# EAGLE board R42_ECU (EAGLE 9.6.2), part 1 of 2
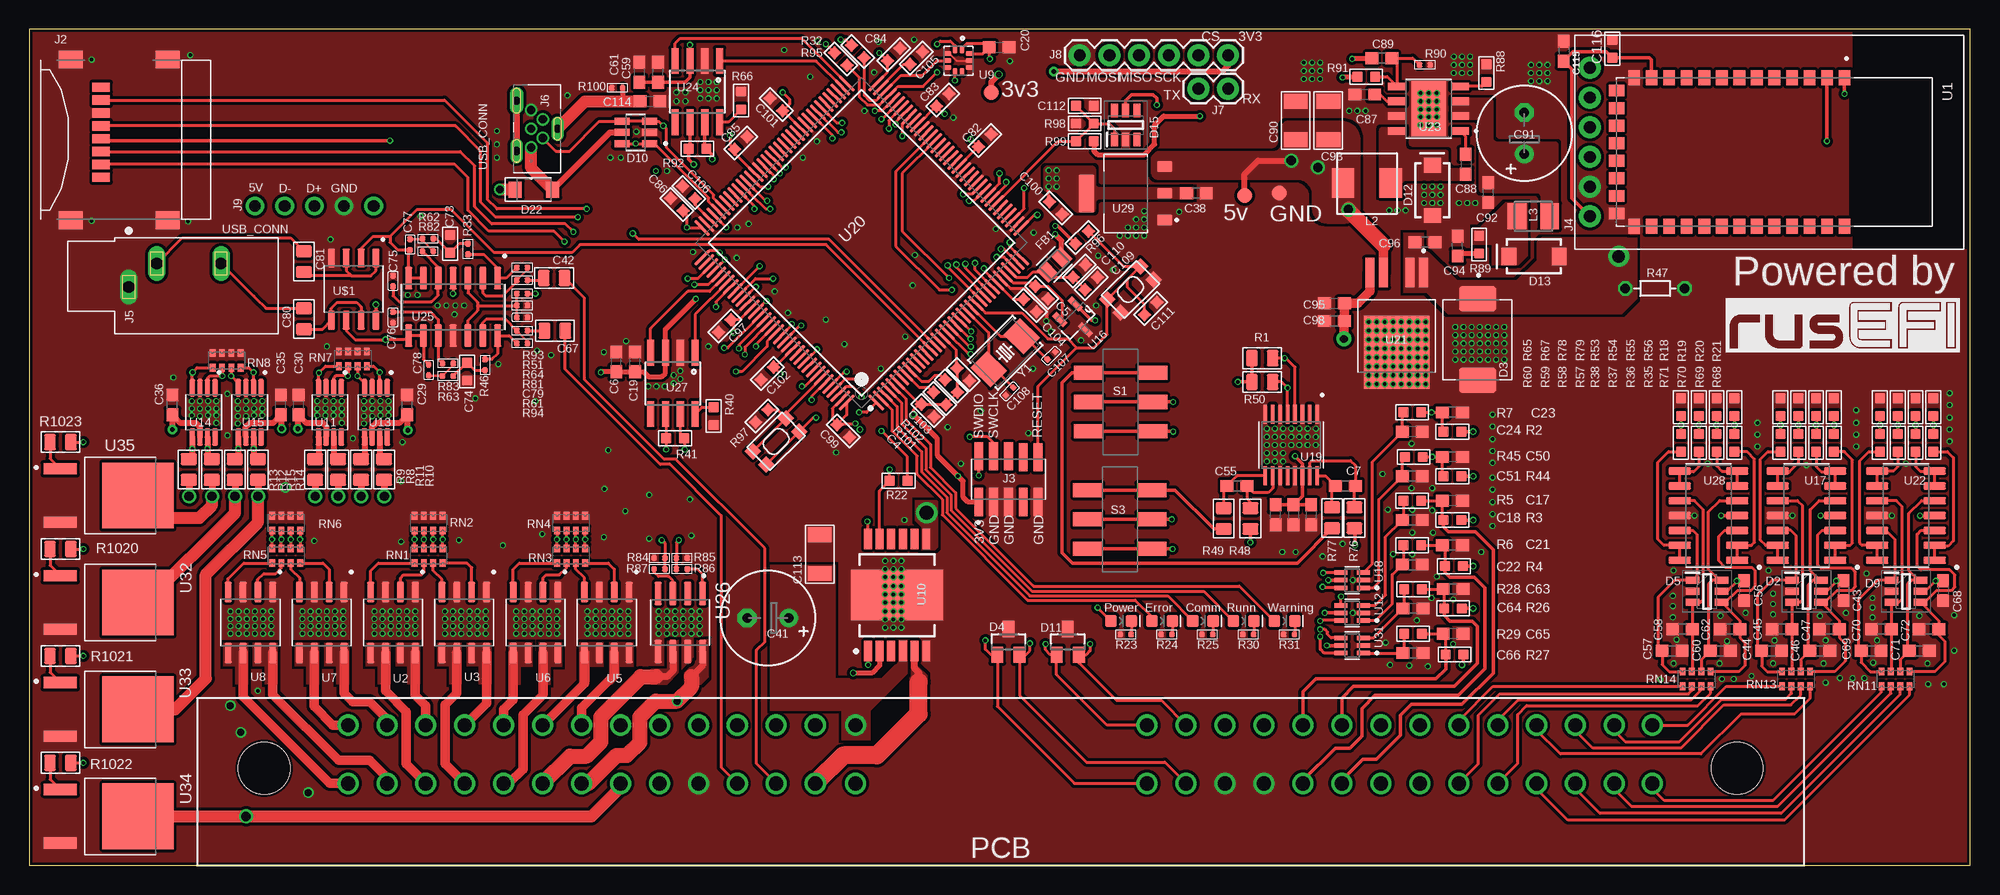
[diagram p7: board, top side]
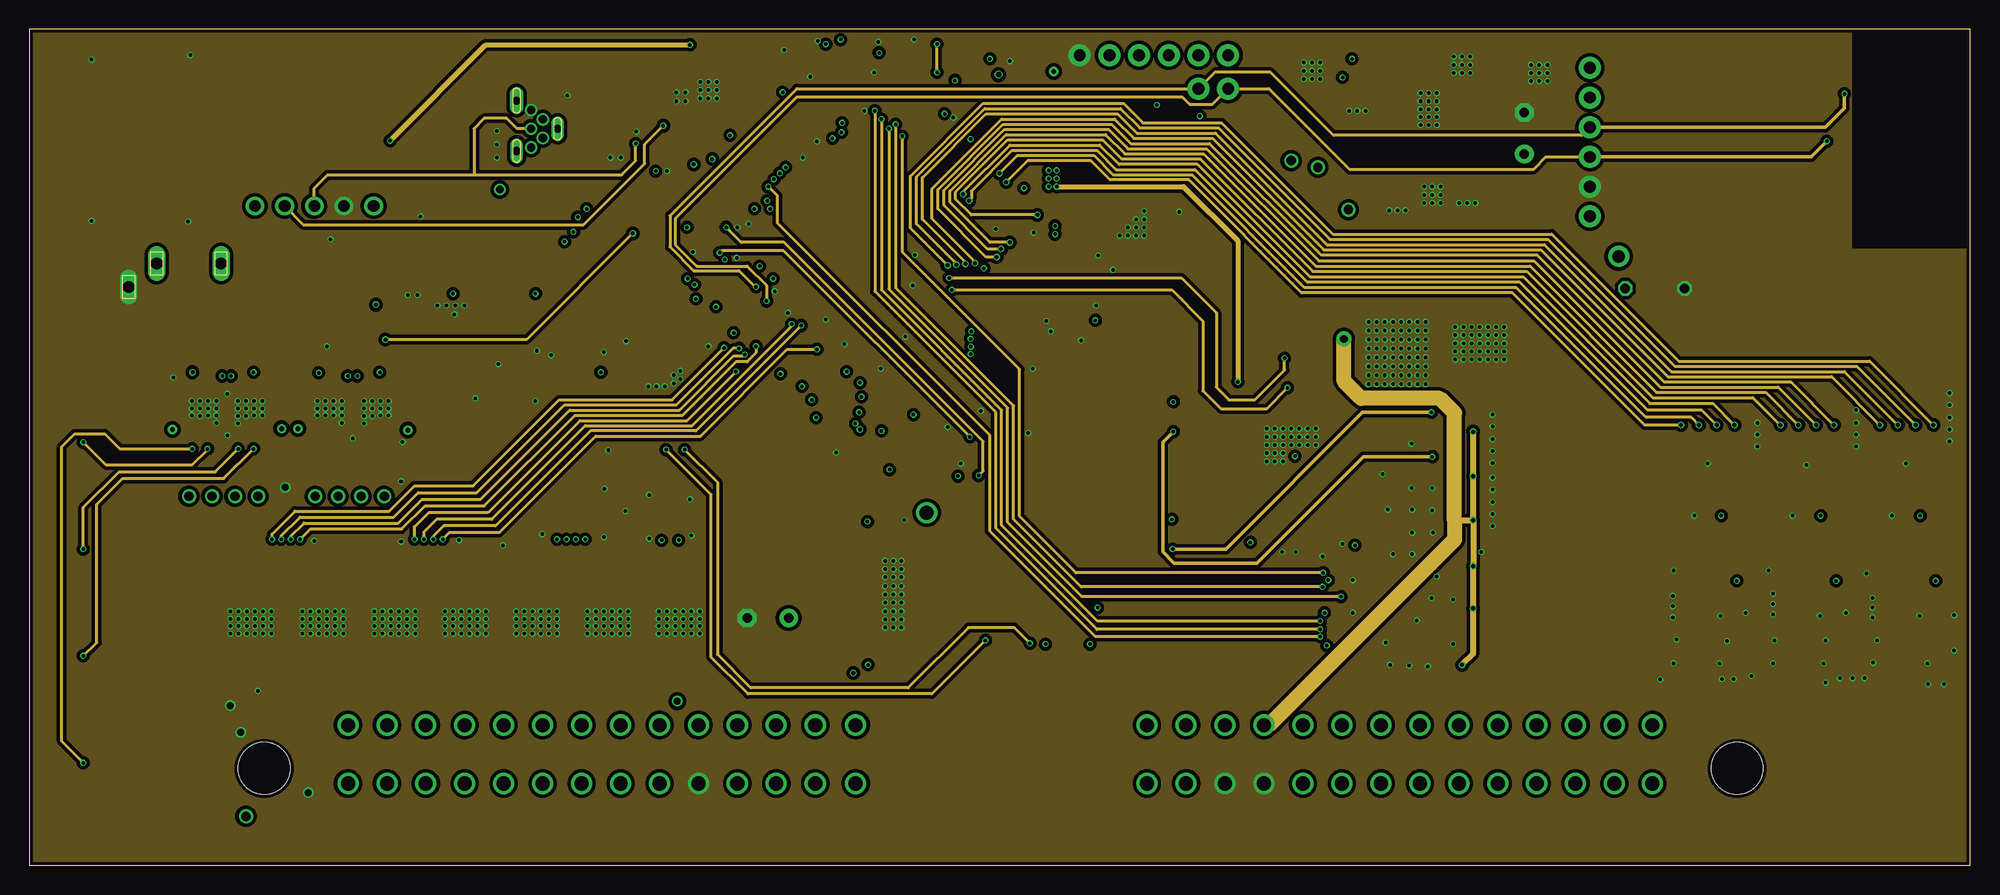
[diagram p8: board, inner layer Route2]
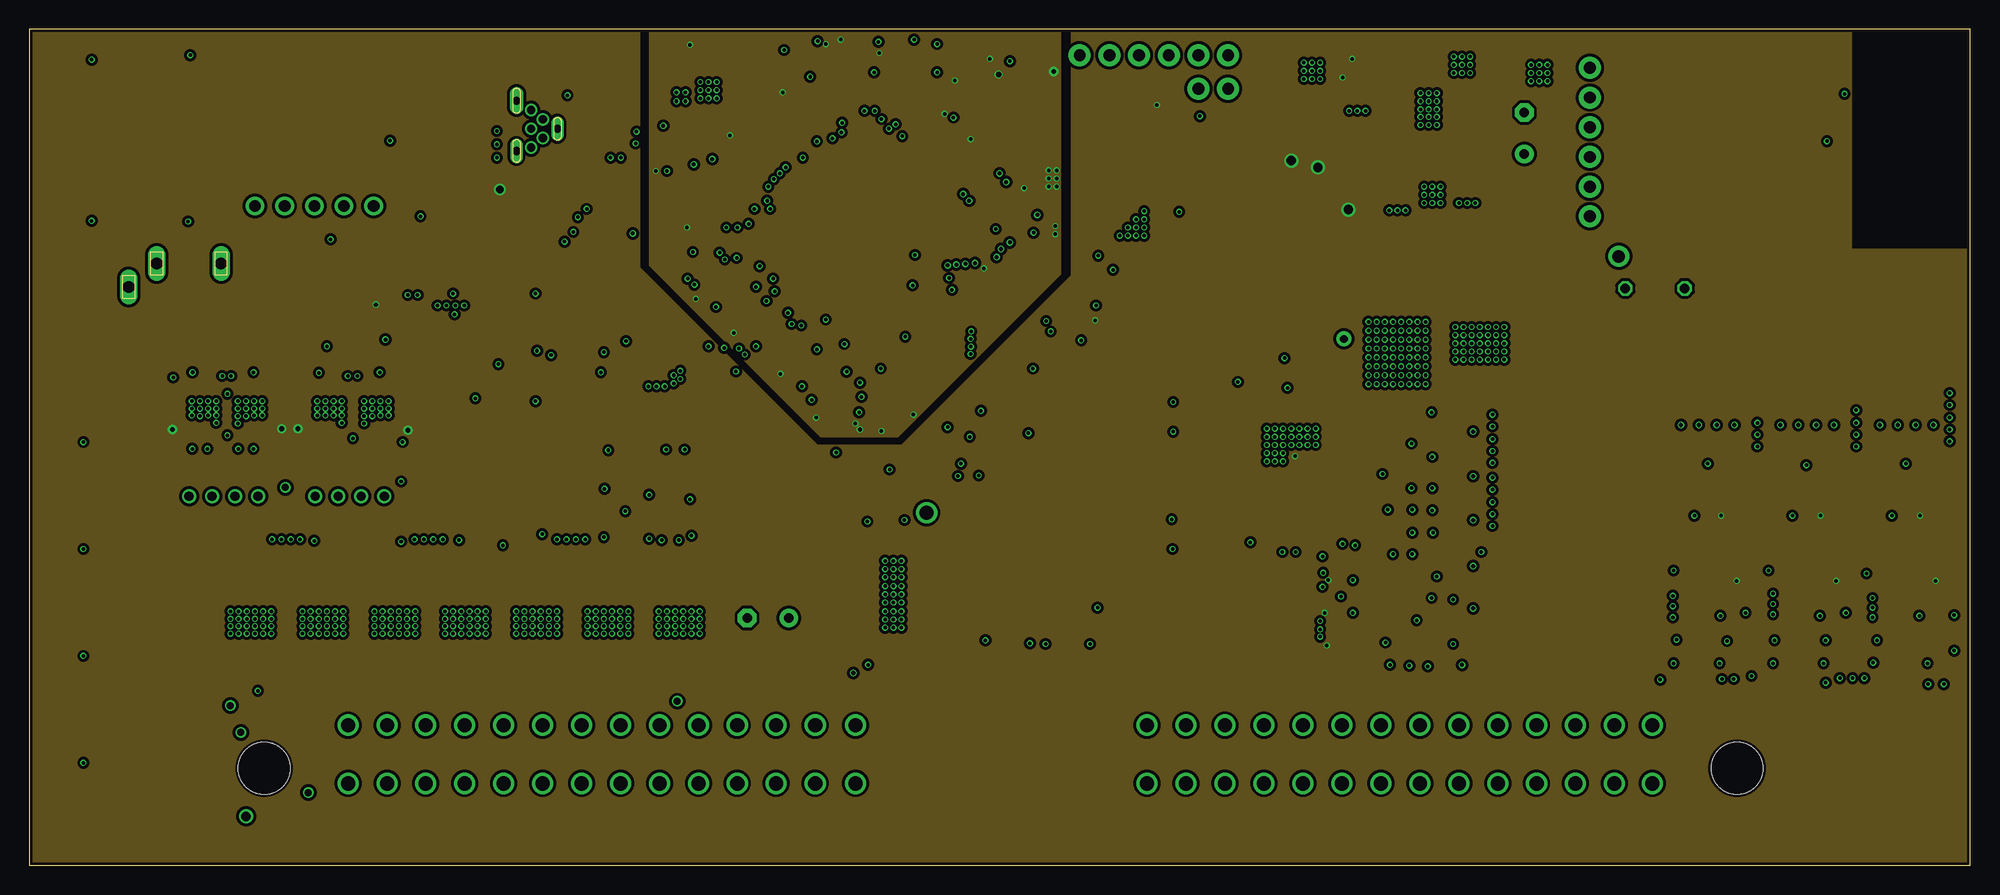
[diagram p9: board, inner layer Route15]
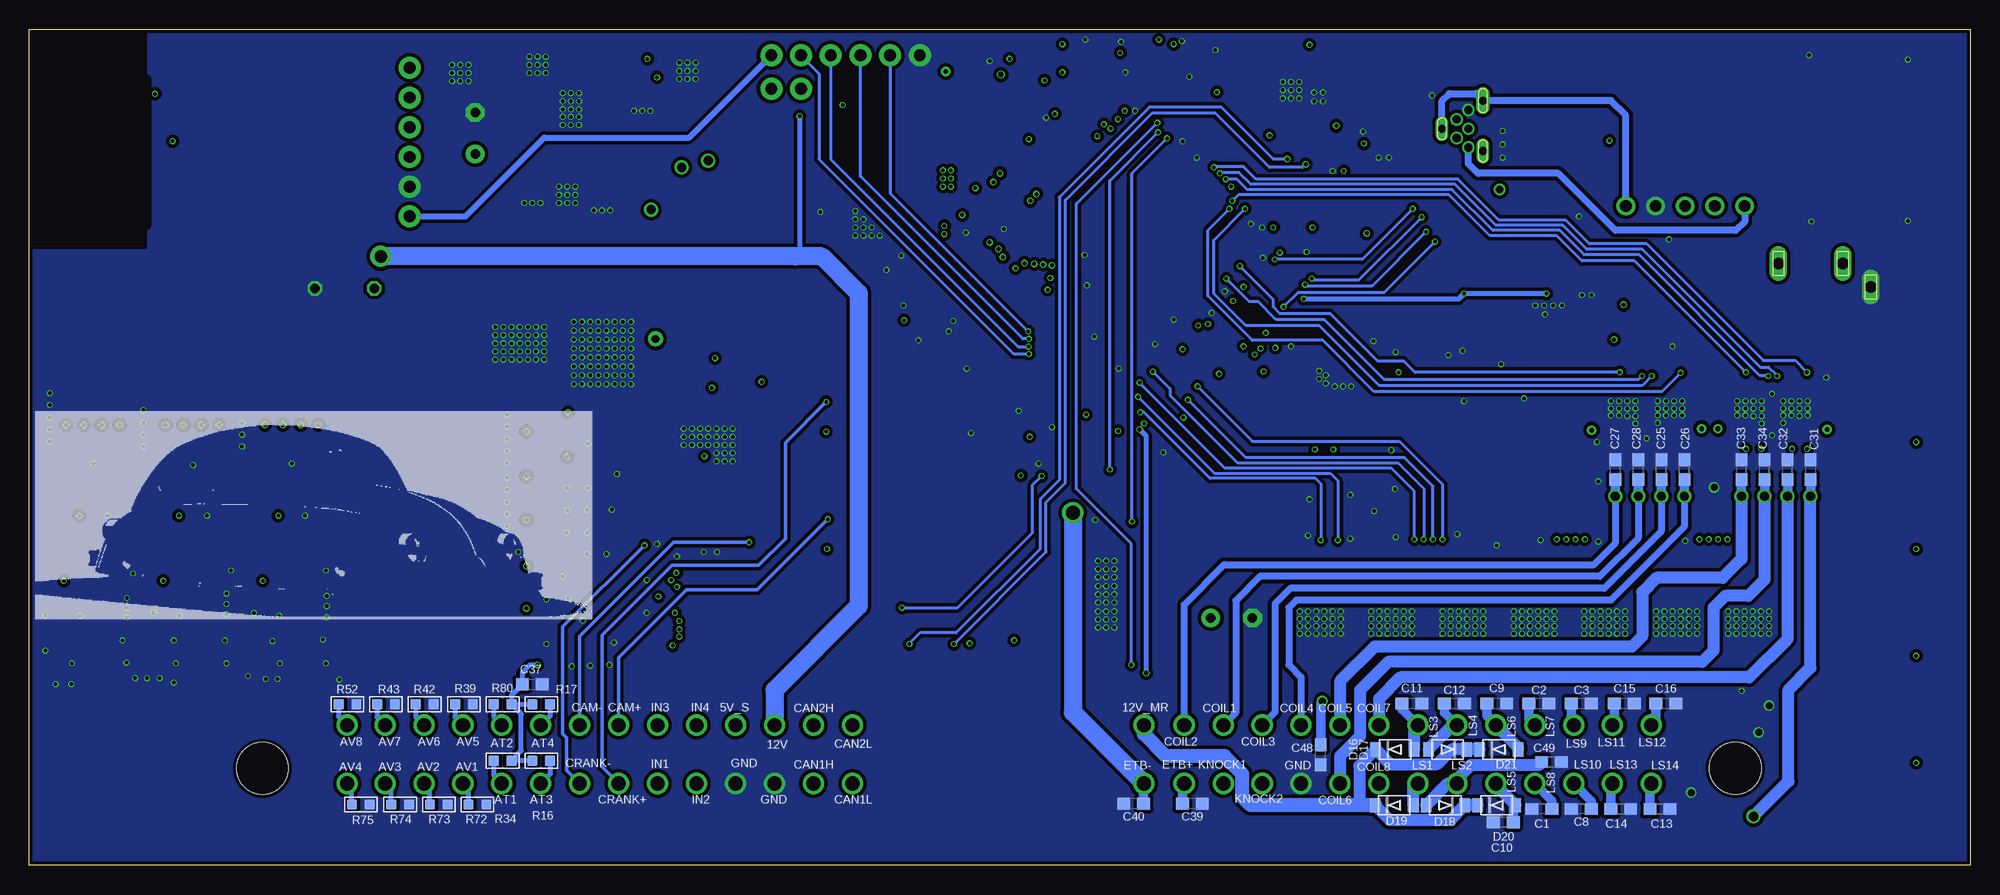
[diagram p10: board, bottom side, seen from below]

Size 166.03 x 71.5 mm. Coordinates in mm from the lower left corner, seen from the top.
Outline: 0,0 166.03,0 166.03,71.5 0,71.5 0,0
Copper layers (1+2*15+16): Top 0.035mm / dielectric 0.2mm / Route2 0.0175mm / dielectric 1.065mm / Route15 0.0175mm / dielectric 0.2mm / Bottom 0.035mm
Design rules "4-Layer-JLC": minimum track width 3.5mil, minimum drill 0.2mm, track to track 3.5mil, track to pad 5mil, pad to pad 5mil, via to via 5mil, smd to smd 0mil, copper to edge 0.1mm, drill to drill 5mil, minimum pad ring 4mil, minimum via ring 4mil, stop-mask expansion 3mil, vias tented up to drill 100mil, thermal gap 10mil

## Footprints (pad centres in the part's own frame; a part is rotated, then mirrored left to right if it is on the bottom)
0603 = smd 1.1 x 1: 1 -0.85,0; 2 0.85,0
C0603 = smd 0.889 x 0.889: 1 0,0.762; 2 0,-0.762
E3,5-8 = drill 0.813 pad 1.6: + -1.778,0 | drill 0.813 pad 1.6 octagon: - 1.778,0
C0805 = smd 1.397 x 1.016: 1 0,0.889; 2 0,-0.889
C0402 = smd 0.5 x 0.5: 1 0,0.463; 2 0,-0.463
C1206 = smd 1.27 x 2.032: 1 -1.651,0; 2 1.651,0
LED-0603 = smd 1 x 1: A -0.877,0; C 0.877,0
SOT95P280X145-6N = smd 1.15 x 0.6: 1 -1.25,0.95; 2 -1.25,0; 3 -1.25,-0.95; 4 1.25,-0.95; 5 1.25,0; 6 1.25,0.95
DIOM7959X262N = smd 2.18 x 3.12: 1 -3.485,0; 2 3.485,0
SOT23 = smd 1 x 1.4: 1 -0.95,-1.1; 2 0.95,-1.1; 3 0,1.1
SOT95P280X145-6N' = smd 1.36 x 0.6: 1 -1.175,0.95; 2 -1.175,0; 3 -1.175,-0.95; 4 1.175,-0.95; 5 1.175,0; 6 1.175,0.95
SMA-DIODE = smd 1.27 x 1.47: A -2.15,0; C 2.15,0
SOD-123FL = smd 0.91 x 1.22: A 1.637,0; C -1.637,0
SODFL3718X115 = smd 1.115 x 1.361: 1 -1.6,0; 2 1.6,0
BEADC2012X105N = smd 1.165 x 1.465: 1 -0.875,0; 2 0.875,0
MOLEX_47219-2001 = smd 0.8 x 1.5: 1 3.2,-2.1; 2 2.1,-2.1; 3 1,-2.1; 4 -0.1,-2.1; 5 -1.2,-2.1; 6 -2.3,-2.1; 7 -3.4,-2.1; 8 -4.5,-2.1 | smd 1.5 x 2.05: G1 6.875,-4.7; G2 6.875,3.6; G3 -6.875,3.6; G4 -6.875,-4.7
62131021021 = smd 0.75 x 2.4: 1 -2.54,-1.95; 2 -2.54,1.95; 3 -1.27,-1.95; 4 -1.27,1.95; 5 0,-1.95; 6 0,1.95; 7 1.27,-1.95; 8 1.27,1.86; 9 2.54,-1.95; 10 2.54,1.86
1X06_NO_SILK = drill 1.016 pad 1.88: 1 0,0; 2 2.54,0; 3 5.08,0; 4 7.62,0; 5 10.16,0; 6 12.7,0
CUI_SJ1-3533NG = drill 1 long: 1 0,0; 2 2.4,2; 3 7.9,2
CONN_1734753-1 = drill 0.7 pad 1: 1 -1.6,0.5; 2 -0.8,-0.5; 3 0,0.5; 4 0.8,-0.5; 5 1.6,0.5 | drill 0.7 long: S1 -1.9,1.75; S3 0,-1.75 | drill 0.7 pad 1.15 long: S2 2.4,1.75
1X02 = drill 1.016 pad 1.88: 1 0,0; 2 2.54,0
1X06 = drill 1.016 pad 1.88: 1 0,0; 2 2.54,0; 3 5.08,0; 4 7.62,0; 5 10.16,0; 6 12.7,0
1X05_NO_SILK = drill 1 pad 1.6: 1 0,0; 2 2.54,0; 3 5.08,0; 4 7.62,0; 5 10.16,0
0503 = smd 1.9 x 2.5: P$1 0,0; P$2 4.1,0
L3225M = smd 1.6 x 2.2: 1 -1.4,0; 2 1.4,0
R0805 = smd 1.397 x 1.016: 1 0,0.889; 2 0,-0.889
R0603 = smd 0.889 x 0.889: 1 0,0.762; 2 0,-0.762
R0402 = smd 0.5 x 0.5: 1 0,0.463; 2 0,-0.463
R-5 = drill 0.813 octagon: 1 -2.54,0; 2 2.54,0
0603-ARC = smd 0.5 x 0.65: 1 -1.2,-0.625; 2 -0.4,-0.625; 3 0.4,-0.625; 4 1.2,-0.625; 5 1.2,0.625; 6 0.4,0.625; 7 -0.4,0.625; 8 -1.2,0.625
SW_JS202011SCQN = smd 1.2 x 2.5: 1 -2.5,-2.75; 2 0,-2.75; 3 2.5,-2.75; 4 -2.5,2.75; 5 0,2.75; 6 2.5,2.75
KMR2 = smd 1 x 1: 1 2,0.8; 2 2,-0.8; 3 -2,0.8; 4 -2,-0.8
PAD.03X.05 = smd 1.27 x 1.27: P$1 0,0
XCVR_HC-05 = smd 1.3 x 1: 1 -6.35,6.325; 2 -6.35,4.825; 3 -6.35,3.325; 4 -6.35,1.825; 5 -6.35,0.325; 6 -6.35,-1.175; 7 -6.35,-2.675; 8 -6.35,-4.175; 9 -6.35,-5.675; 10 -6.35,-7.175; 11 -6.35,-8.675; 12 -6.35,-10.175; 13 -6.35,-11.675; 22 6.35,-11.675; 23 6.35,-10.175; 24 6.35,-8.675; 25 6.35,-7.175; 26 6.35,-5.675; 27 6.35,-4.175; 28 6.35,-2.675; 29 6.35,-1.175; 30 6.35,0.325; 31 6.35,1.825; 32 6.35,3.325; 33 6.35,4.825; 34 6.35,6.325 | smd 1 x 1.3: 14 -5.25,-13.175; 15 -3.75,-13.175; 16 -2.25,-13.175; 17 -0.75,-13.175; 18 0.75,-13.175; 19 2.25,-13.175; 20 3.75,-13.175; 21 5.25,-13.175
SOIC127P600X175-8N = smd 1.71 x 0.61: 1 -2.605,1.905; 2 -2.605,0.635; 3 -2.605,-0.635; 4 -2.605,-1.905; 5 2.605,-1.905; 6 2.605,-0.635; 7 2.605,0.635; 8 2.605,1.905
PQFN60P250X250X80-10N = smd 0.59 x 0.4: 1 -0.92,0.3; 2 -0.92,-0.3; 6 0.92,-0.3; 7 0.92,0.3 | smd 0.4 x 0.59: 3 -0.6,-0.92; 4 0,-0.92; 5 0.6,-0.92; 8 0.6,0.92; 9 0,0.92; 10 -0.6,0.92
SOP100P1030X260-13N = smd 1.753 x 0.66: 1 -4.801,2.489; 2 -4.801,1.499; 3 -4.801,0.508; 4 -4.801,-0.508; 5 -4.801,-1.499; 6 -4.801,-2.489; 7 4.801,-2.489; 8 4.801,-1.499; 9 4.801,-0.508; 10 4.801,0.508; 11 4.801,1.499; 12 4.801,2.489 | smd 4.293 x 7.899: 13 0,0
SOP65P490X110-8N = smd 1.5 x 0.49: 1 -2.105,0.975; 2 -2.105,0.325; 3 -2.105,-0.325; 4 -2.105,-0.975; 5 2.105,-0.975; 6 2.105,-0.325; 7 2.105,0.325; 8 2.105,0.975
SOP65P210X110-6N = smd 1.19 x 0.4: 1 -0.96,0.65; 2 -0.96,0; 3 -0.96,-0.65; 4 0.96,-0.65; 5 0.96,0; 6 0.96,0.65
SOT95P237X112-3N = smd 1.321 x 0.559: 1 -1.092,0.94; 2 -1.092,-0.94 | smd 1.321 x 0.508: 3 1.092,0
SOIC127P600X175-14N = smd 1.9 x 0.6: 1 -2.455,3.81; 2 -2.455,2.54; 3 -2.455,1.27; 4 -2.455,0; 5 -2.455,-1.27; 6 -2.455,-2.54; 7 -2.455,-3.81; 8 2.455,-3.81; 9 2.455,-2.54; 10 2.455,-1.27; 11 2.455,0; 12 2.455,1.27; 13 2.455,2.54; 14 2.455,3.81
SOP63P602X175-16N = smd 1.64 x 0.41: 1 -2.635,2.223; 2 -2.635,1.587; 3 -2.635,0.953; 4 -2.635,0.318; 5 -2.635,-0.318; 6 -2.635,-0.953; 7 -2.635,-1.587; 8 -2.635,-2.223; 9 2.635,-2.223; 10 2.635,-1.587; 11 2.635,-0.953; 12 2.635,-0.318; 13 2.635,0.318; 14 2.635,0.953; 15 2.635,1.587; 16 2.635,2.223
STMICROELECTRONICS_STM32F429ZGT6_2 = smd 1.8 x 0.3: 1 -10.55,8.75; 2 -10.55,8.25; 3 -10.55,7.75; 4 -10.55,7.25; 5 -10.55,6.75; 6 -10.55,6.25; 7 -10.55,5.75; 8 -10.55,5.25; 9 -10.55,4.75; 10 -10.55,4.25; 11 -10.55,3.75; 12 -10.55,3.25; 13 -10.55,2.75; 14 -10.55,2.25; 15 -10.55,1.75; 16 -10.55,1.25; 17 -10.55,0.75; 18 -10.55,0.25; 19 -10.55,-0.25; 20 -10.55,-0.75; 21 -10.55,-1.25; 22 -10.55,-1.75; 23 -10.55,-2.25; 24 -10.55,-2.75; 25 -10.55,-3.25; 26 -10.55,-3.75; 27 -10.55,-4.25; 28 -10.55,-4.75; 29 -10.55,-5.25; 30 -10.55,-5.75; 31 -10.55,-6.25; 32 -10.55,-6.75; 33 -10.55,-7.25; 34 -10.55,-7.75; 35 -10.55,-8.25; 36 -10.55,-8.75; 73 10.55,-8.75; 74 10.55,-8.25; 75 10.55,-7.75; 76 10.55,-7.25; 77 10.55,-6.75; 78 10.55,-6.25; 79 10.55,-5.75; 80 10.55,-5.25; 81 10.55,-4.75; 82 10.55,-4.25; 83 10.55,-3.75; 84 10.55,-3.25; 85 10.55,-2.75; 86 10.55,-2.25; 87 10.55,-1.75; 88 10.55,-1.25; 89 10.55,-0.75; 90 10.55,-0.25; 91 10.55,0.25; 92 10.55,0.75; 93 10.55,1.25; 94 10.55,1.75; 95 10.55,2.25; 96 10.55,2.75; 97 10.55,3.25; 98 10.55,3.75; 99 10.55,4.25; 100 10.55,4.75; 101 10.55,5.25; 102 10.55,5.75; 103 10.55,6.25; 104 10.55,6.75; 105 10.55,7.25; 106 10.55,7.75; 107 10.55,8.25; 108 10.55,8.75 | smd 0.3 x 1.8: 37 -8.75,-10.55; 38 -8.25,-10.55; 39 -7.75,-10.55; 40 -7.25,-10.55; 41 -6.75,-10.55; 42 -6.25,-10.55; 43 -5.75,-10.55; 44 -5.25,-10.55; 45 -4.75,-10.55; 46 -4.25,-10.55; 47 -3.75,-10.55; 48 -3.25,-10.55; 49 -2.75,-10.55; 50 -2.25,-10.55; 51 -1.75,-10.55; 52 -1.25,-10.55; 53 -0.75,-10.55; 54 -0.25,-10.55; 55 0.25,-10.55; 56 0.75,-10.55; 57 1.25,-10.55; 58 1.75,-10.55; 59 2.25,-10.55; 60 2.75,-10.55; 61 3.25,-10.55; 62 3.75,-10.55; 63 4.25,-10.55; 64 4.75,-10.55; 65 5.25,-10.55; 66 5.75,-10.55; 67 6.25,-10.55; 68 6.75,-10.55; 69 7.25,-10.55; 70 7.75,-10.55; 71 8.25,-10.55; 72 8.75,-10.55; 109 8.75,10.55; 110 8.25,10.55; 111 7.75,10.55; 112 7.25,10.55; 113 6.75,10.55; 114 6.25,10.55; 115 5.75,10.55; 116 5.25,10.55; 117 4.75,10.55; 118 4.25,10.55; 119 3.75,10.55; 120 3.25,10.55; 121 2.75,10.55; 122 2.25,10.55; 123 1.75,10.55; 124 1.25,10.55; 125 0.75,10.55; 126 0.25,10.55; 127 -0.25,10.55; 128 -0.75,10.55; 129 -1.25,10.55; 130 -1.75,10.55; 131 -2.25,10.55; 132 -2.75,10.55; 133 -3.25,10.55; 134 -3.75,10.55; 135 -4.25,10.55; 136 -4.75,10.55; 137 -5.25,10.55; 138 -5.75,10.55; 139 -6.25,10.55; 140 -6.75,10.55; 141 -7.25,10.55; 142 -7.75,10.55; 143 -8.25,10.55; 144 -8.75,10.55
TO114P998X235-5 = smd 2.52 x 0.79: 1 -4.34,2.28; 2 -4.34,1.14; 4 -4.34,-1.14; 5 -4.34,-2.28 | smd 6.23 x 5.57: 3 2.48,0
VREG_LM5017MR/NOPB = smd 1.55 x 0.6: 1 -2.7,1.905; 2 -2.7,0.635; 3 -2.7,-0.635; 4 -2.7,-1.905; 5 2.7,-1.905; 6 2.7,-0.635; 7 2.7,0.635; 8 2.7,1.905 | smd 2.95 x 4.9: 9 0,0
SO08 = smd 0.61 x 2.21: 1 -1.905,-2.616; 2 -0.635,-2.616; 3 0.635,-2.616; 4 1.905,-2.616; 5 1.905,2.616; 6 0.635,2.616; 7 -0.635,2.616; 8 -1.905,2.616
SOIC127P600X175-8N' = smd 1.97 x 0.6: 1 -2.475,1.905; 2 -2.475,0.635; 3 -2.475,-0.635; 4 -2.475,-1.905; 5 2.475,-1.905; 6 2.475,-0.635; 7 2.475,0.635; 8 2.475,1.905
SOT229P700X180-4N = smd 0.93 x 1.31: 1 -2.29,-3.345; 2 0,-3.345; 3 2.29,-3.345 | smd 3.24 x 1.31: 4 0,3.345
TO229P990X238-4N = smd 2.83 x 0.97: 1 -4.14,2.29; 3 -4.14,-2.29 | smd 6.09 x 5.63: 4 2.51,0
SOIC127P599X175-8N = smd 1.58 x 0.6: 1 -2.67,1.905; 2 -2.67,0.635; 3 -2.67,-0.635; 4 -2.67,-1.905; 5 2.67,-1.905; 6 2.67,-0.635; 7 2.67,0.635; 8 2.67,1.905
211PL562L0011 = drill 1.2: P1 -55.83,-2.5; P2 -52.5,-2.5; P3 -49.17,-2.5; P4 -45.84,-2.5; P5 -42.51,-2.5; P6 -39.18,-2.5; P7 -35.85,-2.5; P8 -32.52,-2.5; P9 -29.19,-2.5; P10 -25.86,-2.5; P11 -22.53,-2.5; P12 -19.2,-2.5; P13 -15.86,-2.5; P14 -12.4,-2.5; P15 -12.4,2.5; P16 -15.86,2.5; P17 -19.2,2.5; P18 -22.53,2.5; P19 -25.86,2.5; P20 -29.19,2.5; P21 -32.52,2.5; P22 -35.85,2.5; P23 -39.18,2.5; P24 -42.51,2.5; P25 -45.84,2.5; P26 -49.17,2.5; P27 -52.5,2.5; P28 -55.83,2.5; P29 12.5,-2.5; P30 15.86,-2.5; P31 19.2,-2.5; P32 22.53,-2.5; P33 25.86,-2.5; P34 29.19,-2.5; P35 32.52,-2.5; P36 35.85,-2.5; P37 39.18,-2.5; P38 42.51,-2.5; P39 45.84,-2.5; P40 49.17,-2.5; P41 52.5,-2.5; P42 55.73,-2.5; P43 55.73,2.5; P44 52.5,2.5; P45 49.17,2.5; P46 45.84,2.5; P47 42.51,2.5; P48 39.18,2.5; P49 35.85,2.5; P50 32.52,2.5; P51 29.19,2.5; P52 25.86,2.5; P53 22.53,2.5; P54 19.2,2.5; P55 15.86,2.5; P56 12.5,2.5 | hole 4.4: -63,-1.2; 63,-1.2
CRYSTAL_2-SMD-5X3 = smd 2 x 2.4: 1 -2,0; 2 2,0

## Placement (x,y rotation side)
C1  10nF  [0603]  36.64,4.83 180 bottom
C2  10nF  [0603]  36.89,13.84 0 bottom
C3  10nF  [0603]  33.27,13.84 0 bottom
C4  10nf  [C0603]  76.84,38.91 45 top
C5  10nf  [C0603]  85.6,47.86 45 top
C6  1.0uF  [0603]  50.23,43.05 90 top
C7  1nF  [0603]  112.59,32.45 0 top
C8  10nF  [0603]  33.27,4.83 180 bottom
C9  10nF  [0603]  40.51,13.84 0 bottom
C10  10nF  [0603]  39.94,3.68 180 bottom
C11  10nF  [0603]  47.75,13.84 0 bottom
C12  10nF  [0603]  44.13,13.84 0 bottom
C13  10nF  [0603]  26.54,4.83 0 bottom
C14  10nF  [0603]  29.91,4.83 0 bottom
C15  10nF  [0603]  29.59,13.84 0 bottom
C16  10nF  [0603]  26.04,13.84 0 bottom
C17  1nF  [0603]  121.73,31.18 180 top
C18  1nF  [0603]  118.3,29.53 180 top
C19  100nF  [0603]  51.82,43.05 90 top
C20  100nF  [0603]  82.97,69.95 0 top
C21  1nF  [0603]  121.73,27.37 180 top
C22  1nF  [0603]  118.3,25.72 0 top
C23  1nF  [0603]  121.73,38.73 180 top
C24  1nF  [0603]  118.3,37.08 180 top
C25  10nF  [0603]  26.42,33.85 90 bottom
C26  10nF  [0603]  24.45,33.85 90 bottom
C27  10nF  [0603]  30.35,33.85 90 bottom
C28  10nF  [0603]  28.38,33.85 90 bottom
C29  100nF  [0603]  32.32,39.37 90 top
C30  100nF  [0603]  23.05,39.37 90 top
C31  10nF  [0603]  15.62,33.85 90 bottom
C32  10nF  [0603]  13.65,33.85 90 bottom
C33  10nF  [0603]  19.56,33.85 90 bottom
C34  10nF  [0603]  17.59,33.85 90 bottom
C35  100nF  [0603]  21.53,39.37 90 top
C36  100nF  [0603]  12.26,39.37 90 top
C37  100nF  [0603]  123,15.49 0 bottom
C38  4.7uF  [0603]  99.82,57.47 180 top
C39  10nF  [0603]  66.55,5.27 180 bottom
C40  10nF  [0603]  71.56,5.27 180 bottom
C41  56uF  [E3,5-8]  63.18,21.15 180 top
C42  3.3nf  [C0805]  44.89,50.23 270 top
C43  33nF  [0603]  155.19,23.5 270 top
C44  100nF  [0603]  149.03,18.35 0 top
C45  100nF  [0603]  149.92,20.19 180 top
C46  100nF  [0603]  153.16,18.35 0 top
C47  100nF  [0603]  153.99,20.19 180 top
C48  10nF  [0603]  55.56,9.46 90 bottom
C49  10nF  [0603]  35.81,8.83 180 bottom
C50  1nF  [0603]  121.73,34.92 180 top
C51  1nF  [0603]  118.3,33.27 180 top
C52  100nF  [0603]  106.62,29.97 90 top
C53  1.0uF  [0603]  108.14,29.97 270 top
C54  10nF  [0603]  109.66,29.97 90 top
C55  1nF  [0603]  103.31,32.45 0 top
C56  33nF  [0603]  146.69,23.5 270 top
C57  100nF  [0603]  140.53,18.35 0 top
C58  100nF  [0603]  141.41,20.19 180 top
C59  1.0uF  [0603]  53.78,67.82 90 top
C60  100nF  [0603]  144.65,18.35 0 top
C61  100nF  [0603]  52.2,67.82 90 top
C62  100nF  [0603]  145.48,20.19 180 top
C63  1nF  [0603]  121.79,23.62 180 top
C64  1nF  [0603]  118.36,21.97 180 top
C65  1nF  [0603]  121.79,19.81 180 top
C66  1nF  [0603]  118.36,18.16 0 top
C67  3.3nf  [C0805]  44.96,45.72 270 top
C68  33nF  [0603]  163.7,23.5 270 top
C69  100nF  [0603]  157.54,18.35 0 top
C70  100nF  [0603]  158.43,20.19 180 top
C71  100nF  [0603]  161.67,18.35 0 top
C72  100nF  [0603]  162.5,20.19 180 top
C73  680pf  [C0603]  36,53.15 180 top
C74  680pf  [C0603]  37.47,42.23 180 top
C75  47PF  [C0402]  31.11,49.97 180 top
C76  47PF  [C0402]  31.11,46.86 180 top
C77  330PF 50V  [C0402]  32.58,53.09 0 top
C78  330PF 50V  [C0402]  34.16,42.35 0 top
C79  10nf  [C0402]  42.16,46.86 90 top
C80  10uf  [C0805]  23.5,46.74 180 top
C81  10uf  [C0805]  23.5,51.63 180 top
C82  10nf  [C0603]  81.75,61.97 135 top
C83  10nf  [C0603]  78.14,65.46 135 top
C84  10nf  [C0603]  73.95,69.33 135 top
C85  10nf  [C0603]  60.87,61.77 135 top
C86  10nf  [C0603]  55.39,56.5 225 top
C87  10nF  [0603]  114.24,65.91 180 top
C88  100nF  [0603]  122.87,59.94 270 top
C89  270PF  [0603]  115.7,69.02 180 top
C90  10uf  [C1206]  108.33,63.69 90 top
C91  56uF  [E3,5-8]  127.89,62.61 90 top
C92  1.0uF  [0603]  124.78,57.53 270 top
C93  10uf  [C1206]  111.12,63.69 90 top
C94  4.7uF  [0603]  122.17,52.96 90 top
C95  1.0uF  [0603]  111.63,48.07 0 top
C96  1.0uF  [0603]  119.38,53.28 180 top
C97  10nf  [C0603]  59.51,46.13 315 top
C98  22uf  [0603]  111.63,46.55 0 top
C99  10nf  [C0603]  69.63,37.15 45 top
C100  4.7uf  [C0603]  87.82,56.22 45 top
C101  4.7uf  [C0603]  63.91,65.06 225 top
C102  4.7uf  [C0603]  63.14,42.08 315 top
C103  4.7uf  [C0603]  79.9,41.99 45 top
C104  10nf  [C0603]  86.61,49 225 top
C105  2.2uf  [C0603]  75.86,69.03 315 top
C106  2.2uf  [C0603]  56.43,57.53 45 top
C107  33pf  [C0402]  87.43,43.58 135 top
C108  33pf  [C0402]  83.86,40.53 315 top
C109  10nf  [C0603]  90.84,49.76 315 top
C110  4.7uF  [C0603]  89.8,50.84 315 top
C111  10nf  [C0603]  95.93,47.61 135 top
C112  1uf  [C0603]  90.3,64.96 270 top
C113  10uf  [C1206]  67.63,26.61 90 top
C114  100nf  [0603]  53.09,65.34 0 top
C115  100nF  [0603]  131.25,69.62 270 top
C116  1uf  [C0603]  135.43,69.83 180 top
D1  BLUE  [LED-0603]  100.39,20.89 0 top
D2  SRV05-4.TCT  [SOT95P280X145-6N]  152.02,23.43 0 top
D3  SM15T33CA  [DIOM7959X262N]  123.89,44.96 270 top
D4  PESD1CAN  [SOT23]  83.76,19.11 0 top
D5  SRV05-4.TCT  [SOT95P280X145-6N]  143.51,23.43 0 top
D6  GREEN  [LED-0603]  93.41,20.89 0 top
D7  GREEN  [LED-0603]  103.89,20.89 0 top
D8  RED  [LED-0603]  96.9,20.89 0 top
D9  SRV05-4.TCT  [SOT95P280X145-6N]  160.53,23.43 0 top
D10  USBLC6-2SC6  [SOT95P280X145-6N']  51.88,62.67 180 top
D11  PESD1CAN  [SOT23]  88.84,19.11 0 top
D12  C8678  [SMA-DIODE]  120.02,57.72 90 top
D13  C8678  [SMA-DIODE]  128.71,52.07 180 top
D14  Yellow  [LED-0603]  107.38,20.89 0 top
D15  SRV05-4.TCT  [SOT95P280X145-6N]  93.79,63.31 90 top
D16  MBR0520LT1G  [SOD-123FL]  49.21,9.91 0 bottom
D17  MBR0520LT1G  [SOD-123FL]  44.7,9.91 180 bottom
D18  MBR0520LT1G  [SOD-123FL]  44.89,5.14 180 bottom
D19  MBR0520LT1G  [SOD-123FL]  49.28,5.14 0 bottom
D20  MBR0520LT1G  [SOD-123FL]  40.51,5.14 0 bottom
D21  MBR0520LT1G  [SOD-123FL]  40.32,9.91 0 bottom
D22  MBR0520LT1G  [SODFL3718X115]  43.18,57.78 0 top
FB1  FERRITE_BEAD  [BEADC2012X105N]  87.69,51.37 45 top
J2  47219-2001  [MOLEX_47219-2001]  8.26,62.04 270 top
J3  62131021021  [62131021021]  83.76,33.02 0 top
J4  [1X06_NO_SILK]  133.48,55.5 90 top
J5  SJ1-3533NG  [CUI_SJ1-3533NG]  8.51,49.47 0 top
J6  1734753-1  [CONN_1734753-1]  43.43,62.99 90 top
J7  [1X02]  100.01,66.42 0 top
J8  [1X06]  89.85,69.28 0 top
J9  USB_CONN  [1X05_NO_SILK]  19.3,56.39 0 top
L2  10U  [0503]  116.46,58.36 180 top
L3  2.2U  [L3225M]  128.65,55.5 0 top
R1  10K  [R0805]  105.47,43.37 270 top
R2  2.2K  [R0603]  121.73,37.08 270 top
R3  2.2K  [R0603]  121.73,29.53 270 top
R4  2.2K  [R0603]  121.86,25.59 90 top
R5  3.3K  [R0603]  118.3,31.18 270 top
R6  3.3K  [R0603]  118.3,27.37 270 top
R7  3.3K  [R0603]  118.3,38.73 270 top
R8  100R  [R0805]  26.42,33.85 0 top
R9  100R  [R0805]  24.45,33.85 0 top
R10  100R  [R0805]  30.35,33.85 0 top
R11  100R  [R0805]  28.38,33.85 0 top
R12  100R  [R0805]  15.62,33.85 0 top
R13  100R  [R0805]  13.65,33.85 0 top
R14  100R  [R0805]  19.56,33.85 0 top
R15  100R  [R0805]  17.59,33.85 0 top
R16  2.7K  [R0603]  122.24,8.95 270 bottom
R17  2.7K  [R0603]  122.24,13.78 270 bottom
R18  10K  [R0603]  158.31,39.18 0 top
R19  10K  [R0603]  159.83,39.18 0 top
R20  10K  [R0603]  161.35,39.18 0 top
R21  10K  [R0603]  162.88,39.18 0 top
R22  10K  [R0603]  74.36,32.89 90 top
R23  330R  [R0402]  93.79,19.75 270 top
R24  330R  [R0402]  97.28,19.75 270 top
R25  330R  [R0402]  100.77,19.75 270 top
R26  2.2K  [R0603]  121.79,21.97 270 top
R27  2.2K  [R0603]  121.92,18.03 90 top
R28  3.3K  [R0603]  118.36,23.62 270 top
R29  3.3K  [R0603]  118.36,19.81 270 top
R30  330R  [R0402]  104.27,19.75 270 top
R31  330R  [R0402]  107.76,19.75 270 top
R32  2.2K  [R0603]  70.86,69.59 45 top
R33  12K  [R0402]  37.53,52.7 180 top
R34  2.7K  [R0603]  125.54,8.95 90 bottom
R35  5.6K  [R0603]  154.37,36.13 180 top
R36  5.6K  [R0603]  152.84,36.13 180 top
R37  5.6K  [R0603]  151.32,36.13 180 top
R38  5.6K  [R0603]  149.8,36.13 180 top
R39  470K  [R0603]  128.84,13.78 270 bottom
R40  10K  [R0603]  58.55,38.42 180 top
R41  120R  [R0603]  55.24,36.51 90 top
R42  470K  [R0603]  132.21,13.78 270 bottom
R43  470K  [R0603]  135.51,13.78 270 bottom
R44  2.2K  [R0603]  121.73,33.27 270 top
R45  3.3K  [R0603]  118.43,34.92 270 top
R46  12K  [R0402]  38.99,42.8 0 top
R47  B72530T6170K062  [R-5]  139.06,49.34 0 top
R48  10K  [R0805]  104.46,29.65 0 top
R49  10K  [R0805]  102.17,29.65 0 top
R50  10K  [R0805]  105.47,41.34 270 top
R51  100K  [R0402]  42.16,50.04 270 top
R52  470K  [R0603]  138.81,13.78 270 bottom
R53  10K  [R0603]  149.8,39.18 0 top
R54  10K  [R0603]  151.32,39.18 0 top
R55  10K  [R0603]  152.84,39.18 0 top
R56  10K  [R0603]  154.37,39.18 0 top
R57  5.6K  [R0603]  145.86,36.13 180 top
R58  5.6K  [R0603]  144.34,36.13 180 top
R59  5.6K  [R0603]  142.81,36.13 180 top
R60  5.6K  [R0603]  141.29,36.13 180 top
R61  100K  [R0402]  42.16,45.72 270 top
R62  100K  [R0402]  34.1,53.59 270 top
R63  100K  [R0402]  35.81,41.85 270 top
R64  22K  [R0402]  42.16,48.9 90 top
R65  10K  [R0603]  141.29,39.18 0 top
R66  10K  [R0603]  60.9,65.41 0 top
R67  10K  [R0603]  142.81,39.18 0 top
R68  5.6K  [R0603]  162.88,36.13 180 top
R69  5.6K  [R0603]  161.35,36.13 180 top
R70  5.6K  [R0603]  159.83,36.13 180 top
R71  5.6K  [R0603]  158.31,36.13 180 top
R72  470K  [R0603]  127.7,5.21 270 bottom
R73  470K  [R0603]  131,5.21 270 bottom
R74  470K  [R0603]  134.3,5.21 270 bottom
R75  470K  [R0603]  137.67,5.21 270 bottom
R76  10K  [R0805]  113.35,29.72 0 top
R77  10K  [R0805]  111.44,29.72 0 top
R78  10K  [R0603]  144.34,39.18 0 top
R79  10K  [R0603]  145.86,39.18 0 top
R80  2.7k  [R0603]  125.54,13.78 90 bottom
R81  22K  [R0402]  42.16,47.88 270 top
R82  33K  [R0402]  34.1,52.51 270 top
R83  33K  [R0402]  35.81,42.93 270 top
R84  1K  [R0402]  53.91,25.34 90 top
R85  1K  [R0402]  55.82,25.34 270 top
R86  1K  [R0402]  55.82,26.29 270 top
R87  1K  [R0402]  53.91,26.29 90 top
R88  10K  [R0603]  124.65,67.75 0 top
R89  1R  [R0603]  124.02,53.09 0 top
R90  12K  [R0402]  119.38,68.45 90 top
R91  68K  [R0603]  114.36,67.44 270 top
R92  120R  [R0603]  57.15,61.28 90 top
R93  470K  [R0402]  42.16,51.12 270 top
R94  470K  [R0402]  42.16,44.64 270 top
R95  2.2K  [R0603]  69.42,68.96 225 top
R96  10K  [R0603]  90.05,53.68 135 top
R97  10K  [R0603]  62.68,38.42 135 top
R98  10K  [R0603]  90.3,63.44 90 top
R99  82k  [R0603]  90.3,61.91 90 top
R100  100K  [R0402]  50.29,66.48 90 top
R101  10K  [R0603]  77.87,39.92 45 top
R102  10K  [R0603]  78.87,40.98 45 top
R1020  330R  [R0805]  2.67,27.05 90 top
R1021  330R  [R0805]  2.67,17.91 270 top
R1022  330R  [R0805]  2.67,8.76 90 top
R1023  330r  [R0805]  2.67,36.2 90 top
RN1  1K  [0603-ARC]  34.16,26.48 0 top
RN2  1K  [0603-ARC]  34.16,29.27 180 top
RN3  1K  [0603-ARC]  46.35,26.48 0 top
RN4  1K  [0603-ARC]  46.35,29.27 180 top
RN5  1K  [0603-ARC]  21.97,26.48 0 top
RN6  1K  [0603-ARC]  21.97,29.27 180 top
RN7  1K  [0603-ARC]  27.69,43.31 180 top
RN8  1K  [0603-ARC]  16.89,43.18 180 top
RN11  10K  [0603-ARC]  159.64,15.94 180 top
RN13  10K  [0603-ARC]  151.13,15.94 180 top
RN14  10K  [0603-ARC]  142.62,15.94 180 top
S1  JS202011SCQN  [SW_JS202011SCQN]  93.34,39.62 90 top
S3  JS202011SCQN  [SW_JS202011SCQN]  93.28,29.59 90 top
SW1  SPST_TACT-KMR2  [KMR2]  94.2,49.24 45 top
SW2  SPST_TACT-KMR2  [KMR2]  63.88,36.25 225 top
TP1  TEST-POINT3X5  [PAD.03X.05]  103.95,57.27 0 top
TP2  TEST-POINT3X5  [PAD.03X.05]  82.3,66.08 0 top
TP3  TEST-POINT3X5  [PAD.03X.05]  106.9,57.48 0 top
U1  HC-05  [XCVR_HC-05]  148.95,61 270 top
U2  VNS3NV04DP-E  [SOIC127P600X175-8N]  31.11,20.76 270 top
U3  VNS3NV04DP-E  [SOIC127P600X175-8N]  37.21,20.76 270 top
U5  VNS3NV04DP-E  [SOIC127P600X175-8N]  49.4,20.76 270 top
U6  VNS3NV04DP-E  [SOIC127P600X175-8N]  43.31,20.76 270 top
U7  VNS3NV04DP-E  [SOIC127P600X175-8N]  25.02,20.76 270 top
U8  VNS3NV04DP-E  [SOIC127P600X175-8N]  18.92,20.76 270 top
U9  LPS25HBTR  [PQFN60P250X250X80-10N]  79.49,68.82 270 top
U10  TLE9201SG  [SOP100P1030X260-13N]  74.23,23.11 90 top
U11  MIC4427YMM-TR  [SOP65P490X110-8N]  25.72,38.73 270 top
U12  74HC2G17  [SOP65P210X110-6N]  113.16,21.59 180 top
U13  MIC4427YMM-TR  [SOP65P490X110-8N]  29.65,38.73 270 top
U14  MIC4427YMM-TR  [SOP65P490X110-8N]  14.92,38.73 270 top
U15  MIC4427YMM-TR  [SOP65P490X110-8N]  18.86,38.73 270 top
U16  REF3033AIDBZR  [SOT95P237X112-3N]  89.58,46.56 315 top
U17  MCP6004-E/SL  [SOIC127P600X175-14N]  152.02,29.91 180 top
U18  74HC2G17  [SOP65P210X110-6N]  113.16,24.38 180 top
U19  MAX9926UAEE+  [SOP63P602X175-16N]  107.95,35.94 270 top
U20  STMICROELECTRONICS_STM32F429ZGT6STMICROELECTRONICS_STM32F429ZGT6_0_2  [STMICROELECTRONICS_STM32F429ZGT6_2]  71.2,53.23 135 top
U21  TLE4251DATMA1  [TO114P998X235-5]  116.97,46.35 270 top
U22  MCP6004-E/SL  [SOIC127P600X175-14N]  160.53,29.91 180 top
U23  LMR14020SDDAR  [VREG_LM5017MR/NOPB]  119.7,64.71 180 top
U24  VD230  [SO08]  57.15,66.17 180 top
U25  MCP6004-E/SL  [SOIC127P600X175-14N]  36.26,47.75 270 top
U26  VNLD5090TR-E  [SOIC127P600X175-8N']  55.69,20.76 270 top
U27  VD230  [SO08]  55.05,41.21 180 top
U28  MCP6004-E/SL  [SOIC127P600X175-14N]  143.64,29.91 180 top
U29  AMS1117-3.3  [SOT229P700X180-4N]  93.79,57.47 90 top
U31  74HC2G17  [SOP65P210X110-6N]  113.16,18.8 180 top
U32  ISL9V3040D3STV  [TO229P990X238-4N]  6.79,22.48 0 top
U33  ISL9V3040D3STV  [TO229P990X238-4N]  6.79,13.34 0 top
U34  ISL9V3040D3STV  [TO229P990X238-4N]  6.79,4.19 0 top
U35  ISL9V3040D3STV  [TO229P990X238-4N]  6.79,31.62 0 top
U$1  MCP6002-E/SN  [SOIC127P599X175-8N]  27.75,49.28 270 top
U$3  211PL562L0011  [211PL562L0011]  83.1,9.5 0 top
Y1  CRYSTAL_NX5032GA  [CRYSTAL_2-SMD-5X3]  83.48,43.83 225 top

## Tracks (layer width: path | path; a pad name or v marks a point on that pad's centre or on a via)
3V3  (via drill 0.3, 0.35, 0.4 pad 0.8, 0.45)
  Top 0.254: 79.29,42.53 C103.1 | v80.52,62.1 81.19,61.44 C82.1 81.17,61.44 U20.52 | 77.56,64.92 C83.1 | v78.3,64.26 78.22,64.26 77.56,64.92 | v82.17,68.96 82.12,69.01 C20.1 | v79.18,67.12 79.18,67.89 U9.6 | U9.10 81.58,69.42 C20.1 | U9.1 79.79,69.89 80.2,70.29 81.78,70.29 C20.1 | v72.71,69.47 72.73,69.47 C84.1 73.41,67.84 72.47,66.9 U20.72 | v64.45,66.1 65.02,65.53 65.02,65.09 C101.1 64.5,64.52 U20.84 | v59.94,62.42 59.94,61.62 C85.1 60.34,60.91 U20.95 | v64.26,42.04 C102.1 63.77,42.62 U20.131 | SW2.1 SW2.3 67.06,38.29 v67.31,38.29 | R22.2 75.12,34.92 v72.9,37.15 | v68.14,70.23 v68.15,70.23 R95.2 | v69.41,70.61 69.84,70.61 R32.1 | v91.38,22.04 D6.A | U20.108 56.31,54.5 v56.26,54.55 56.26,55.63 C86.1 | U20.62 77.56,64.9 77.56,64.92 | U20.39 85.09,56.16 v85.09,57.91 | C100.1 87.19,56.86 v87.19,58.04 | C5.1 84.16,48.4 U20.30 81.66,50.9 v81.66,51.05 | U20.17 79.29,44.07 79.29,42.53 | 69.13,37.74 69.18,37.78 | 69.18,37.78 v70.67,37.78 | U20.144 69.92,38.53 69.18,37.78 | 69.13,37.74 C99.1 | U20.143 68.71,39.07 68.71,38.16 69.13,37.74 | U20.121 60.75,46.67 C97.1 60.26,46.46 v60.26,45.53 | 79.29,42.53 79.41,42.41 R102.2 78.41,39.45 R101.2 78.34,39.45 C4.1 76.14,39.45 | U20.6 76.14,39.45 | v75.63,38.54 75.63,38.94 76.14,39.45 | U25.4 v36.26,48.9 | R64.2 v43.31,48.9
  Top 0.305: C61.1 C59.1 56.11,66.97 56.52,67.37 U24.3 v56.52,70.17 | R96.1 87.97,54.67 v87.76,54.67 | v30.86,61.98 6.32,61.98 J2.4 | 48.93,42.2 v48.9,42.16 | R1.2 R50.2 v103.38,41.34 | U1.12 138.75,67.38 138.75,68.88 138.56,69.06 C116.1 134.91,69.58 132.05,69.58 C115.2 131.95,68.08 131.95,57.03 J4.1
  Top 0.406: v57.02,48.45 54.42,45.85 U27.3 54.42,42.1 54.1,41.78 52.96,41.78 52.54,42.2 C19.1 C6.1 48.93,42.2 | U10.2 72.73,17.11 72.07,16.45 v70.48,16.45 | v75.63,38.54 77.66,36.51 77.66,35.07 v79.44,33.29 79.88,32.85 79.88,31.5 80.31,31.07 J3.1 | FB1.2 88.31,53.42 v87.76,53.98
  Top 0.508: J8.6 102.55,68.39 102.04,67.88 v87.63,67.88 | TP2.P$1 82.3,67 v82.92,67.62
  Route2 0.406: v87.88,58.04 98.74,58.04 103.38,53.4 v103.38,41.34 | v30.86,61.98 39.05,70.17 v56.52,70.17
  Bottom 0.254: v91.38,22.04 86.61,22.04 80.2,28.45 80.2,32.53 v79.44,33.29
  Bottom 0.406: v71.06,37.27 70.48,36.7 v70.48,16.45 | v36.26,48.9 v43.31,48.9 43.75,48.45 v57.02,48.45
  Bottom 0.508: J4.1 128.71,55.5 121.98,62.23 109.6,62.23 J8.6
  other vias: 87.88,59.44 87.88,58.74 87.19,59.44 87.19,58.74 53.59,59.37
  pour Route15 (isolate 0.254): 53.02,71.5 53.02,51.31 67.69,36.64 74.3,36.64 88.27,50.61 88.27,71.5
  pour Top (isolate 0.254, no thermals): 99.57,57.98 99.57,56.96 91.5,56.96 arc90 91.19,56.64 91.19,56.13 arc-90 90.87,55.82 89.73,55.82 arc-45 89.51,55.91 87.91,57.5 arc45 87.69,57.59 87.12,57.59 arc-90 86.8,57.91 86.8,59.5 arc-90 87.12,59.82 90.87,59.82 arc-90 91.19,59.5 91.19,58.29 arc90 91.5,57.98
5V  (via drill 0.3, 0.35, 0.4 pad 0.8, 0.65, 0.8)
  Top 0.254: C56.1 146.07,24.34 v146.05,24.32 146.05,24.26 145.35,23.56 144.89,23.56 D5.5 | C43.1 154.58,24.34 v154.56,24.32 154.56,24.26 153.8,23.5 153.33,23.5 D2.5 | v153.23,29.91 U17.4 | D9.5 162.18,23.43 v163.07,24.32 163.09,24.34 C68.1 | v161.73,29.91 U22.4
  Top 0.305: C53.1 108.9,31.58 U19.14 108.9,34.35 v108.27,34.99 | C52.2 C53.1 | C54.2 C53.1 | D15.5 93.79,65.41 94.3,65.91 96.14,65.91 96.46,65.6 v96.46,65.02 | U31.5 v111,18.8 | v110.81,21.59 U12.5 | v111.12,24.38 U18.5 | U16.1 90.87,46.61 v91.19,46.61 | U$1.8 v29.65,47.94 | U28.4 v144.72,29.91
  Top 0.406: R91.2 113.6,67.37 v112.33,67.37 | v113.16,68.96 113.16,69.03 C89.2
  Top 0.508: U13.6 29.33,37.5 29.65,37.82 31.62,37.82 C29.1 32.38,38.46 v32.38,37.21 | U11.6 25.39,37.56 25.13,37.82 23.75,37.82 C30.1 22.99,38.46 v22.99,37.34 | U15.6 18.54,37.5 18.86,37.82 20.83,37.82 C35.1 21.59,38.46 v21.59,37.34 | U14.6 14.6,37.5 14.27,37.82 12.95,37.82 C36.1 v12.26,37.27 | TP1.P$1 103.95,59.1 105.11,60.26 v107.95,60.26
  Top 0.813: U21.4 115.83,53.02 115.82,53.02
  Top 1.016: D22.1 v40.26,57.78
  Top 1.27: 115.82,53.02 112.84,56.01 v112.84,56.07
  other vias: 110.24,59.69
  pour Top (isolate 0.305, no thermals): 109.73,57.4 109.73,56.2 arc90 111,54.93 112.59,54.93 arc90 113.86,56.2 113.86,62.04 arc90 112.27,63.63 107.7,63.63 arc90 107.06,62.99 107.06,61.66 arc-90 106.43,61.02 96.58,61.02 arc90 95.95,60.39 95.95,59.31 arc90 96.58,58.67 108.46,58.67 arc-90
  pour Route15 (isolate 0.254, rank 2, no thermals): 0,0 166.05,0 166.05,52.7 155.9,52.7 155.9,71.5 89.09,71.5 89.09,50.42 74.61,35.94 67.44,35.94 52.26,51.12 52.26,71.5 0,71.5
5V_SENSORS  (via drill 0.35, 0.65 pad 1.3)
  Top 0.305: R26.1 v123.51,21.97 | R27.2 122.68,17.27 v122.56,17.14 | R4.2 v123.51,25.59 | R3.1 v123.51,29.53 | R44.1 v123.51,33.27 | R2.1 v123.51,37.08
  Top 0.813: U21.5 114.69,49.09 113.67,48.07 C95.2 C98.2 112.46,46.52 v112.46,45.02
  Route2 0.508: v122.56,17.14 123.51,18.1 v123.51,21.97 v123.51,25.59 v123.51,29.53 | v123.51,29.53 v123.51,33.27 v123.51,37.08 | v123.51,29.53 123.44,29.46 121.91,29.46
  Route2 1.27: v112.46,45.02 112.46,41.4 113.92,39.94 120.65,39.94 121.91,38.68 121.91,29.46 121.91,27.86 106.04,12 U$3.P53
  Bottom 0.406: R16.2 R34.2 123.95,9.78 123.95,12.95 R80.2 | R80.2 R17.2 | R80.2 124.78,14.57 C37.1 123.85,16.48 123.19,17.14 v122.56,17.14
12V  (via drill 0.3, 1.1 pad 1.8)
  Top 0.406: R99.2 91.06,61.09 91.38,60.77 95.38,60.77 96.27,61.66 96.27,63.31 97.03,64.07 v100.14,64.07
  Bottom 0.406: v100.14,64.07 100.14,52.45 100.52,52.07
  Bottom 1.524: v135.95,52.07 100.52,52.07 98.23,52.07 95.09,48.93 95.09,22.19 102.3,14.99 U$3.P54
  pour Top (isolate 0.305, no thermals): 136.21,47.18 137.54,48.51 137.54,53.66 129.33,53.66 128.97,53.29 128.97,51.72 127.22,49.97 122.17,49.97 119.32,52.83 119.32,54.04 117.54,54.04 117.54,49.02 119.51,49.02 121.35,47.18
12V_DIVIDED
  Top 0.254: C112.2 R98.2 | R98.2 R99.1 88.01,61.91 U20.43 | R98.2 92.39,63.44 92.84,62.99 D15.1
12V_MR
  Bottom 1.016: D21.C D17.C 44.38,9.91 45.62,8.66 49.6,8.66 D16.C 52.26,8.49 52.26,5.14 | D20.C D18.C 44.53,3.87 49.64,3.87 D19.C
  Bottom 1.2: D19.C 52.26,5.14 61.56,5.14 62.26,5.84 62.26,7.81 63.78,9.34 68.78,9.34 70.7,11.25 U$3.P15
  pour Top (isolate 0.254, no thermals): 74.36,19.24 74.36,17.4 72.9,15.94 68.96,15.94 68.96,25.65 63.37,25.65 63.37,13.27 69.47,13.27 69.47,10.73 71.95,10.73 71.95,13.27 75.12,16.45 75.12,19.24
ANALOG1
  Top 0.254: RN11.8 160.84,14.6 150.11,3.87 131.62,3.87 128.94,6.56 U$3.P39
  Bottom 0.406: R72.2 128.46,6.52 U$3.P39
ANALOG1_MCU  (via drill 0.35)
  Top 0.254: R21.2 v162.88,37.66 R68.2 | U20.26 78.55,51.18 v78.55,51.31
  Route2 0.254: v78.55,51.31 75.37,54.48 75.37,58.93 81.6,65.15 93.6,65.15 95.25,63.5 101.98,63.5 111.51,53.98 130.24,53.98 141.1,43.12 157.42,43.12 v162.88,37.66
ANALOG2
  Top 0.254: RN11.7 160.04,14.62 149.86,4.45 134.35,4.45 132.27,6.53 U$3.P40
  Bottom 0.406: R73.2 131.76,6.5 U$3.P40
ANALOG2_MCU  (via drill 0.35)
  Top 0.254: R20.2 v161.35,37.66 R69.2 | U20.27 79.31,51.12 v79.31,51.37
  Route2 0.254: v79.31,51.37 79.31,51.44 75.88,54.86 75.88,58.86 81.72,64.71 93.34,64.71 95,63.06 101.73,63.06 111.25,53.53 129.92,53.53 140.78,42.67 156.34,42.67 v161.35,37.66
ANALOG3
  Top 0.254: RN11.6 159.24,14.71 149.54,5.02 137.08,5.02 135.6,6.5 U$3.P41
  Bottom 0.406: R74.2 135.06,6.47 U$3.P41
ANALOG3_MCU  (via drill 0.35)
  Top 0.254: R19.2 v159.83,37.66 R70.2 | U20.28 80.07,51.07 v80.07,51.44
  Route2 0.254: v80.07,51.44 80.07,51.56 76.39,55.24 76.39,58.8 81.85,64.26 93.09,64.26 94.74,62.61 101.47,62.61 111,53.09 129.6,53.09 140.46,42.23 155.26,42.23 v159.83,37.66
ANALOG4
  Top 0.254: RN11.5 158.44,14.81 149.16,5.52 139.87,5.52 138.83,6.57 U$3.P42
  Bottom 0.406: R75.2 138.43,6.6 U$3.P42
ANALOG4_MCU  (via drill 0.35)
  Top 0.254: R18.2 v158.31,37.66 R71.2 | U20.29 80.9,50.95 v80.9,51.5
  Route2 0.254: v80.9,51.5 80.9,51.63 77.22,55.31 77.22,57.85 83.19,63.82 92.84,63.82 94.49,62.17 101.22,62.17 110.74,52.64 129.29,52.64 140.14,41.78 154.18,41.78 v158.31,37.66
ANALOG5
  Top 0.254: RN13.8 152.33,14.28 151,12.95 146.43,12.95 143,9.53 130.97,9.53 128.94,11.56 U$3.P46
  Bottom 0.406: R39.2 129.6,12.66 U$3.P46
ANALOG5_MCU  (via drill 0.35)
  Top 0.254: R56.2 v154.37,37.66 R35.2 | U20.34 83.38,52.01 v82.74,52.01
  Route2 0.254: v82.74,52.01 81.85,52.01 77.72,56.13 77.72,57.78 83.31,63.37 92.58,63.37 94.23,61.72 100.97,61.72 110.49,52.2 128.97,52.2 139.83,41.34 142.75,41.34 142.81,41.34 150.69,41.34 v154.37,37.66
ANALOG6
  Top 0.254: RN13.7 151.53,14.56 150.69,13.72 144.97,13.72 141.29,10.03 133.76,10.03 132.27,11.53 U$3.P45
  Bottom 0.406: R42.2 132.97,12.7 U$3.P45
ANALOG6_MCU  (via drill 0.35)
  Top 0.254: R55.2 v152.84,37.66 R36.2 | U20.35 83.39,52.7 v83.12,52.7
  Route2 0.254: v83.12,52.7 81.98,52.7 78.23,56.45 78.23,57.72 83.44,62.93 92.33,62.93 93.98,61.28 100.71,61.28 110.3,51.69 128.71,51.69 139.51,40.89 149.61,40.89 v152.84,37.66
ANALOG7
  Top 0.254: RN13.6 150.73,14.71 150.24,14.22 144.78,14.22 141.1,10.54 136.56,10.54 135.6,11.5 U$3.P44
  Bottom 0.406: R43.2 136.27,12.67 U$3.P44
ANALOG7_MCU  (via drill 0.35)
  Top 0.254: R54.2 v151.32,37.66 R37.2 | U20.36 83.88,52.92 v83.88,53.28
  Route2 0.254: v83.88,53.28 82.17,53.28 78.74,56.71 78.74,57.66 83.57,62.48 92.08,62.48 93.73,60.83 100.46,60.83 110.05,51.24 128.4,51.24 139.19,40.45 148.53,40.45 v151.32,37.66
ANALOG8
  Top 0.254: U$3.P43 141.86,12 145.17,15.31 RN13.5
  Bottom 0.406: R52.2 139.57,12.74 U$3.P43
ANALOG8_MCU  (via drill 0.35)
  Top 0.254: R53.2 v149.8,37.66 R38.2 | U20.37 85.97,55.63 v86.23,55.63
  Route2 0.254: v86.23,55.63 80.58,55.63 79.25,56.96 79.25,57.59 83.69,62.04 91.82,62.04 93.47,60.39 100.2,60.39 109.8,50.79 128.09,50.79 138.88,40.01 147.45,40.01 v149.8,37.66
ANALOG_T1
  Top 0.254: RN14.5 125.21,15.31 122.28,12.38 U$3.P48
  Bottom 0.406: R17.1 121.47,12.8 U$3.P48
ANALOG_T1_MCU  (via drill 0.35)
  Top 0.254: R65.2 v141.29,37.66 R60.2 | U20.44 83.57,58.17 v83.57,58.42
  Route2 0.254: v83.57,58.42 85.41,60.26 90.81,60.26 92.46,58.61 99.19,58.61 108.84,48.96 126.87,48.96 138.18,37.66 v141.29,37.66
ANALOG_T2
  Top 0.254: RN14.6 142.22,14.97 141.92,14.67 125.79,14.67 123.95,12.83 123.95,8.67 U$3.P37
  Bottom 0.406: R16.1 121.47,7.8 U$3.P37
ANALOG_T2_MCU  (via drill 0.35)
  Top 0.254: R67.2 v142.81,37.66 R59.2 | U20.45 83,58.31 v83,59.18
  Route2 0.254: v83,59.18 84.52,60.71 91.06,60.71 92.71,59.05 99.44,59.05 109.09,49.4 127.19,49.4 138.28,38.31 142.15,38.31 v142.81,37.66
ANALOG_T3
  Top 0.254: RN14.7 143.02,15.01 142.18,14.16 127.36,14.16 125.61,12.41 U$3.P47
  Bottom 0.406: R80.1 126.3,12.69 U$3.P47
ANALOG_T3_MCU  (via drill 0.35)
  Top 0.254: R78.2 v144.34,37.66 R58.2 | U20.46 80.81,56.83 v80.39,56.83
  Route2 0.254: v80.39,56.83 80.58,57.02 80.58,57.66 84.07,61.15 91.31,61.15 92.96,59.5 99.69,59.5 109.35,49.85 127.51,49.85 138.43,38.92 143.06,38.92 v144.34,37.66
ANALOG_T4
  Top 0.254: RN14.8 143.82,14.73 142.75,13.65 128.08,13.65 127.32,12.89 127.32,8.71 U$3.P38
  Bottom 0.406: R34.1 126.3,7.69 U$3.P38
ANALOG_T4_MCU  (via drill 0.35)
  Top 0.254: R79.2 v145.86,37.66 R57.2 | U20.47 80.67,57.4 v79.88,57.4
  Route2 0.254: v79.88,57.4 79.88,57.59 83.88,61.59 91.57,61.59 93.22,59.94 99.93,59.94 109.55,50.32 127.8,50.32 138.62,39.5 144.02,39.5 v145.86,37.66
AUX_SPI_CS  (via drill 0.3)
  Top 0.254: U20.18 80.34,43.73 v80.52,43.73
  Bottom 0.254: J8.5 100.01,69.22 98.49,67.69 98.49,60.39 81.83,43.73 v80.52,43.73
AUX_SPI_MISO  (via drill 0.3)
  Top 0.254: U20.20 80.47,45.02 v80.52,45.02
  Bottom 0.254: v80.52,45.02 81.05,45.02 94.93,58.91 J8.3
AUX_SPI_MOSI  (via drill 0.3)
  Top 0.254: U20.21 80.54,45.66 v80.58,45.66
  Bottom 0.254: J8.2 92.39,57.47 v80.58,45.66
AUX_SPI_SCK  (via drill 0.3)
  Top 0.254: U20.19 80.42,44.36 v80.56,44.36
  Bottom 0.254: J8.4 97.47,60.39 81.44,44.36 v80.56,44.36
BARO_SCL  (via drill 0.3)
  Top 0.254: v77.66,67.82 76.45,66.61 74.33,66.61 U20.69 72.74,65.02 71.69,65.02 70.99,65.72 70.99,67.39 R95.1 | v77.66,70.23 77.92,70.48 78.8,70.48 79.19,70.1 U9.2
  Route2 0.254: v77.66,67.82 v77.66,70.23
BARO_SDA
  Top 0.254: U9.4 77.64,68.81 76.39,67.56 74.57,67.56 U20.70 72.41,65.41 71.88,65.41 71.44,65.85 71.44,69.02 R32.2
CAM+  (via drill 0.3)
  Top 0.305: v97.73,29.59 S3.2 S3.5
  Bottom 0.305: v97.73,29.59 103.76,23.56 109.79,23.56 115.62,17.73 U$3.P50
CAM+HALL  (via drill 0.3)
  Top 0.254: R7.1 v119.95,38.73 C23.2 120.88,37.17 R2.2
  Top 0.305: v97.79,27.05 97.75,27.09 S3.1 S3.4
  Route2 0.305: v97.79,27.05 102.36,27.05 114.05,38.73 v119.95,38.73
CAM+VR
  Top 0.305: R49.2 101.35,28.77 98.02,32.09 S3.3 S3.6
CAM-  (via drill 0.3)
  Top 0.305: R48.2 v104.46,27.62
  Bottom 0.305: v104.46,27.62 110.93,27.62 118.95,19.61 U$3.P49
CAM_IN
  Top 0.254: R7.2 117.45,38.65 C24.2 114.87,34.51 114.87,25.79 U18.3
CAM_VR_MCU  (via drill 0.3)
  Top 0.254: U19.5 v107.63,40.83 107.12,41.34 R50.1 | U20.59 74.11,59.32 74.11,52.96 77.85,49.21 v78.93,49.21
  Route2 0.254: v78.93,49.21 97.73,49.21 100.39,46.55 100.39,40.58 101.92,39.05 105.86,39.05 v107.63,40.83
CAN1_RX
  Top 0.254: U27.4 53.15,45.91 56.33,49.09 58.22,49.09 U20.114
CAN1_TX
  Top 0.254: U20.115 56.96,47.12 U27.1
CAN1H  (via drill 0.3)
  Top 0.254: U27.7 55.69,36.83 R41.2 56.07,36.45 v56.07,35.56 | v85.6,18.99 85.6,18.35 85.26,18.01 D4.2 84.71,14.54 90.42,8.83 97.13,8.83 U$3.P30
  Route2 0.254: v85.6,18.99 84.26,20.32 80.33,20.32 75.18,15.18 61.72,15.18 58.86,18.03 58.86,32.77 v56.07,35.56
CAN1L  (via drill 0.3)
  Top 0.254: U27.6 54.48,38.53 R41.1 v54.48,35.56 | v81.79,19.24 81.79,18.48 82.25,18.01 D4.1 82.81,13.59 89.39,7 U$3.P29
  Route2 0.254: v81.79,19.24 77.22,14.67 61.47,14.67 58.29,17.84 58.29,31.75 v54.48,35.56
CAN2_RX
  Top 0.254: U24.4 55.24,70.29 55.63,70.67 66.12,70.67 U20.73
CAN2_TX
  Top 0.254: U20.74 67.31,68.78 U24.1
CAN2H  (via drill 0.3, 0.35)
  Top 0.254: v90.74,18.92 90.74,18.33 90.42,18.01 D11.2 89.79,17.32 93,14.1 96.86,14.1 U$3.P55
  Top 0.305: U24.7 57.78,61.4 R92.2 58.42,60.77 v58.42,60.39
  Bottom 0.254: v58.42,60.39 59.63,60.39 64.07,64.83 70.23,64.83 77.92,57.15 77.92,32.96 79.57,31.3 79.57,27.05 86.74,19.88 89.85,19.88 90.74,18.99 v90.74,18.92
CAN2L  (via drill 0.3, 0.35)
  Top 0.254: v86.93,18.92 86.93,18.41 87.33,18.01 D11.1 87.89,16.32 92.2,12 U$3.P56
  Top 0.305: U24.6 56.52,61.4 R92.1 56.39,60.39 v56.83,59.94
  Bottom 0.254: v86.93,18.92 79.06,26.8 79.06,31.05 77.41,32.7 77.41,56.9 69.98,64.33 64.58,64.33 59.94,59.69 57.15,59.69 56.9,59.94 v56.83,59.94
COIL1  (via drill 0.8)
  Top 0.61: R11.2 28.38,31.57 v28.4,31.56
  Bottom 0.61: v28.4,31.56 28.4,27.99 31.69,24.7 60.77,24.7 62.83,22.64 62.83,13.07 U$3.P17
  Bottom 0.813: C28.1 28.38,31.57 v28.4,31.56
COIL2  (via drill 0.8)
  Top 0.61: R10.2 30.35,31.57 v30.37,31.56
  Bottom 0.61: v30.37,31.56 30.37,27.55 32.19,25.72 63.82,25.72 67.24,22.3 U$3.P16
  Bottom 0.813: C27.1 30.35,31.57 v30.37,31.56
COIL3  (via drill 0.8)
  Top 0.61: R8.2 26.42,31.57 v26.43,31.56
  Bottom 0.61: v26.43,31.56 26.43,28.56 31.3,23.69 58.17,23.69 59.46,22.39 59.46,13.1 U$3.P18
  Bottom 0.813: C25.1 26.42,31.57 v26.43,31.56
COIL4  (via drill 0.8)
  Top 0.61: R9.2 24.45,31.57 v24.46,31.56
  Bottom 0.61: v24.46,31.56 24.46,28.94 30.73,22.67 57.66,22.67 58.29,22.04 58.29,17.14 57.24,16.09 U$3.P19
  Bottom 0.813: C26.1 24.45,31.57 v24.46,31.56
COIL5  (via drill 0.8)
  Top 0.61: R14.2 19.57,32.94 v19.57,31.56
  Top 1.016: U33.4 12.48,13.34 15.11,15.97 15.11,24.89 19.57,29.35 v19.57,31.56
  Bottom 0.813: C33.1 19.57,32.98 v19.57,31.56
  Bottom 1.016: v19.57,31.56 19.57,26.21 21.21,24.57 26.86,24.57 28.07,23.37 28.07,19.57 28.95,18.69 50.94,18.69 53.91,15.73 U$3.P20
COIL6  (via drill 0.8)
  Top 0.61: R15.2 17.6,32.94 v17.6,31.56
  Top 1.016: U32.4 9.97,22.48 17.6,30.11 v17.6,31.56
  Bottom 0.813: C34.1 17.59,31.57 v17.6,31.56
  Bottom 1.016: v17.6,31.56 17.6,24.43 18.99,23.05 20.95,23.05 21.97,22.04 21.97,18.35 22.92,17.4 49.78,17.4 52.2,14.99 52.2,11.05 53.91,9.34 U$3.P9
COIL7  (via drill 0.8)
  Top 0.61: R12.2 15.63,32.94 v15.63,31.56
  Top 1.016: U35.4 11.21,29.72 14.54,29.72 15.63,30.81 v15.63,31.56
  Bottom 0.61: 15.62,31.57 v15.63,31.56
  Bottom 0.813: C31.1 15.62,31.57
  Bottom 1.016: v15.63,31.56 15.63,19.36 18.92,16.07 48.77,16.07 50.58,14.26 U$3.P21
COIL8  (via drill 0.8)
  Top 0.61: R13.2 13.66,32.94 v13.66,31.56
  Top 1.016: U34.4 v18.54,4.19 48.09,4.19 50.58,6.68 U$3.P8
  Bottom 0.61: 13.65,31.57 v13.66,31.56
  Bottom 0.813: C32.1 13.65,31.57
  Bottom 1.016: v18.54,4.19 15.56,7.18 15.56,14.99 13.66,16.88 v13.66,31.56
CRANK+  (via drill 0.3)
  Top 0.305: v97.85,39.62 S1.2 S1.5
  Bottom 0.305: v97.85,39.62 101.35,36.13 101.35,27.94 103.63,25.65 111.06,25.65 117.03,19.68 117.03,8.41 U$3.P35
CRANK+HALL  (via drill 0.3)
  Top 0.254: R45.1 v120.02,34.92 C50.2 120.88,33.36 R44.2
  Top 0.305: v97.85,37.08 97.81,37.12 S1.1 S1.4
  Route2 0.305: v97.85,37.08 96.97,36.2 96.97,26.8 97.92,25.84 105.03,25.84 114.11,34.92 v120.02,34.92
CRANK+VR
  Top 0.305: R77.2 108.46,25.84 89.22,25.84 88.33,26.73 88.33,41.27 89.18,42.12 S1.6 S1.3
CRANK-  (via drill 0.3)
  Top 0.305: v113.41,27.37 113.41,28.77 R76.2
  Bottom 0.305: v113.41,27.37 120.4,20.38 120.4,11.24 120.08,10.92 120.08,8.13 U$3.P36
CRANK_IN
  Top 0.254: R45.2 117.45,34.71 C51.2 115.44,31.27 115.44,24.19 114.98,23.73 U18.1
CRANK_VR_MCU  (via drill 0.3)
  Top 0.254: R1.1 v107.38,43.37 107.5,43.37 108.27,42.61 U19.4 | U20.58 74.68,59.18 74.68,54.23 v78.68,50.23
  Route2 0.254: v78.68,50.23 98.55,50.23 101.54,47.24 101.54,40.89 102.62,39.81 104.84,39.81 107.38,42.35 v107.38,43.37
D+  (via drill 0.3)
  Top 0.254: D10.6 v51.88,61.72 D10.1 53.47,61.72 58.12,57.08 58.12,56.76 U20.104
  Route2 0.254: J9.3 24.38,57.91 25.53,59.05 38.04,59.05 | 38.04,59.05 50.67,59.05 51.88,60.26 v51.88,61.72 | J6.3 41.72,62.99 40.83,63.88 38.92,63.88 38.04,62.99 38.04,59.05
D-  (via drill 0.35)
  Top 0.254: U20.103 58.55,57.04 58.55,57.34 54.48,61.4 54.48,62.99 v54.23,63.25 53.85,63.62 D10.3 D10.4 48.77,63.62 46.23,61.09 45.04,61.09 J6.2
  Route2 0.254: J9.2 23.43,54.8 47.43,54.8 52.64,60.01 52.64,61.66 v54.23,63.25
DIR  (via drill 0.3)
  Top 0.254: U10.1 71.74,17.16 v71.75,17.14 | U20.79 69.06,63.5 v69.53,63.5
  Bottom 0.254: v71.75,17.14 71.75,27.5 76.45,32.19 76.45,56.58 v69.53,63.5
DIS  (via drill 0.3)
  Top 0.254: U10.11 72.73,32.03 R22.1 v73.6,33.85 | U20.80 69.18,62.67 v69.47,62.67
  Bottom 0.254: v73.6,33.85 73.6,58.55 v69.47,62.67
ETB_PWM  (via drill 0.3)
  Top 0.254: U10.12 71.74,29.35 v71.69,29.4 | U20.81 68.71,62.44 v68.71,62.17
  Bottom 0.254: v71.69,29.4 71.69,59.18 v68.71,62.17
FILTERED1
  Top 0.254: U20.14 68.16,53.09 47.12,53.09 46.42,52.39 39.75,52.39 36.07,56.07 33.15,56.07 30.86,53.78 | 30.86,53.78 30.86,53.28 31.51,52.62 C77.2 32.45,52.5 U25.7 U25.6 | U$1.2 28.38,52.77 29.4,53.78 30.86,53.78
FILTERED2  (via drill 0.35)
  Top 0.254: U20.15 68.42,53.53 52.13,53.53 v51.63,54.04 | U$1.6 27.11,45.72 27.88,44.96 v30.48,44.96 32.11,44.96 U25.8 U25.9 33.72,43.26 C78.1
  Route2 0.254: v51.63,54.04 42.55,44.96 v30.48,44.96
GND  (via drill 0.3, 0.6)
  Top 0.152: U9.3 78.73,69.42 79.33,68.81 U9.9
  Top 0.254: U20.31 83.92,49.34 85.15,49.34 87,47.5 v87,46.55